# Altium project SIM_4G_EC200S.PrjPcb
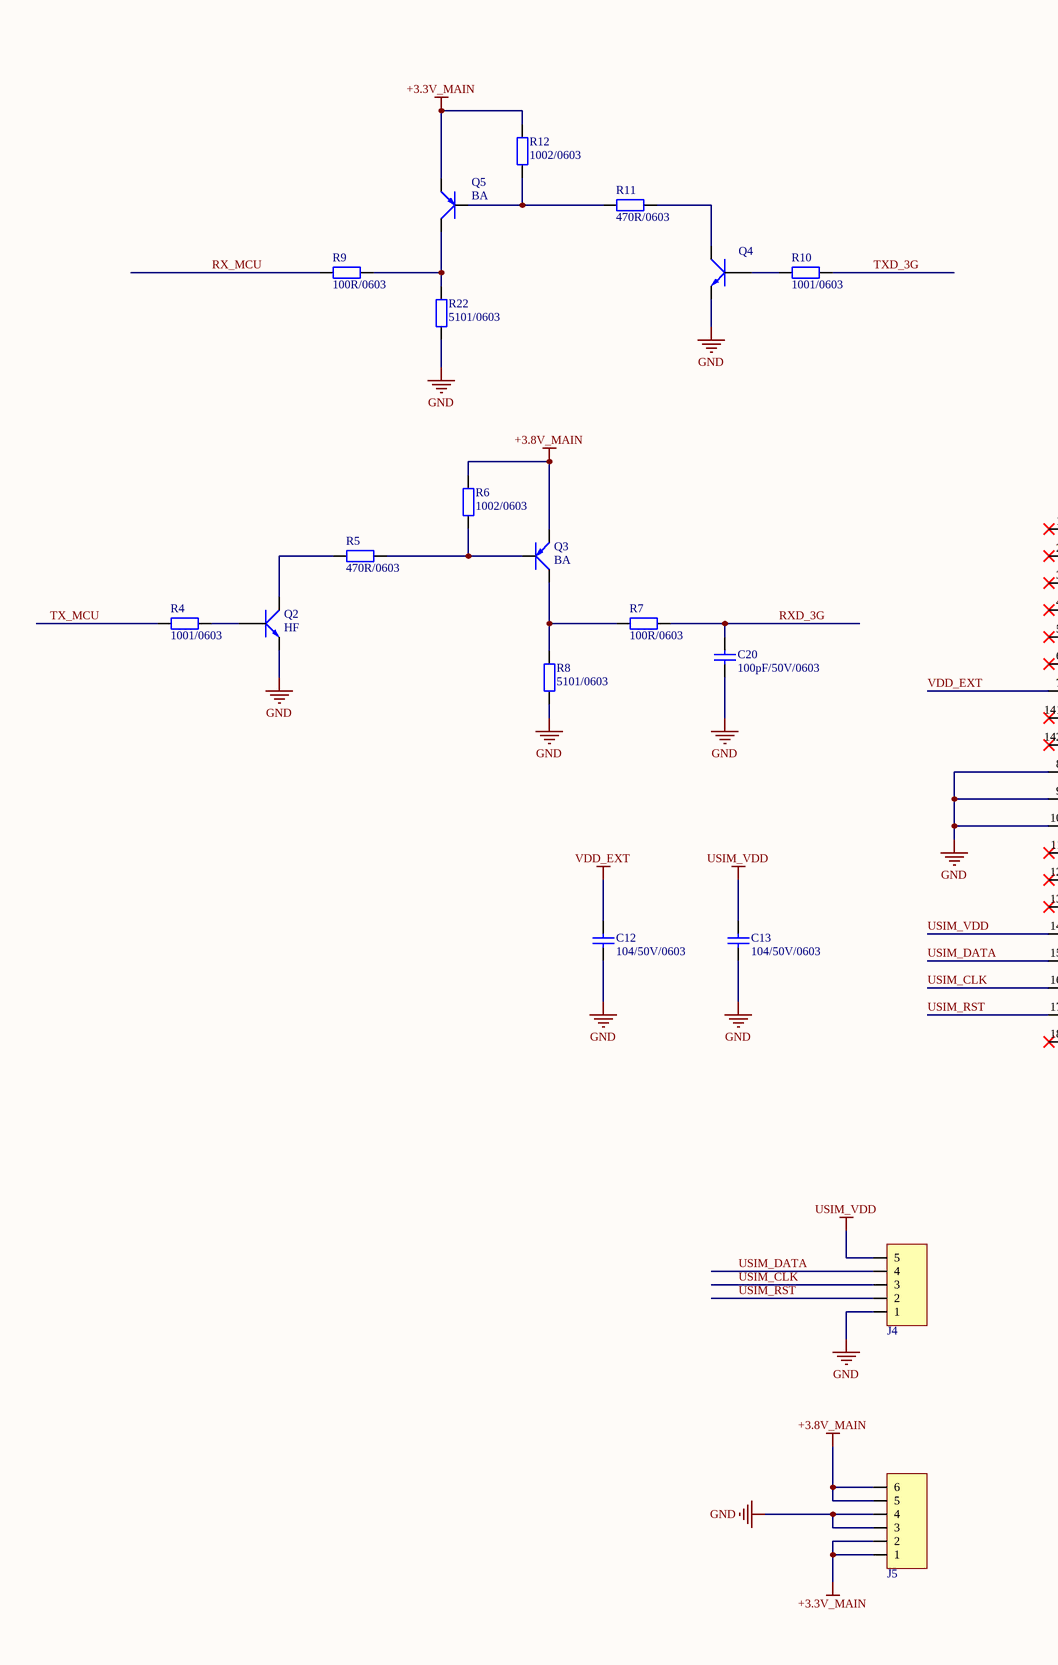
[diagram p0: SIM4G_EC200S.SchDoc, left]
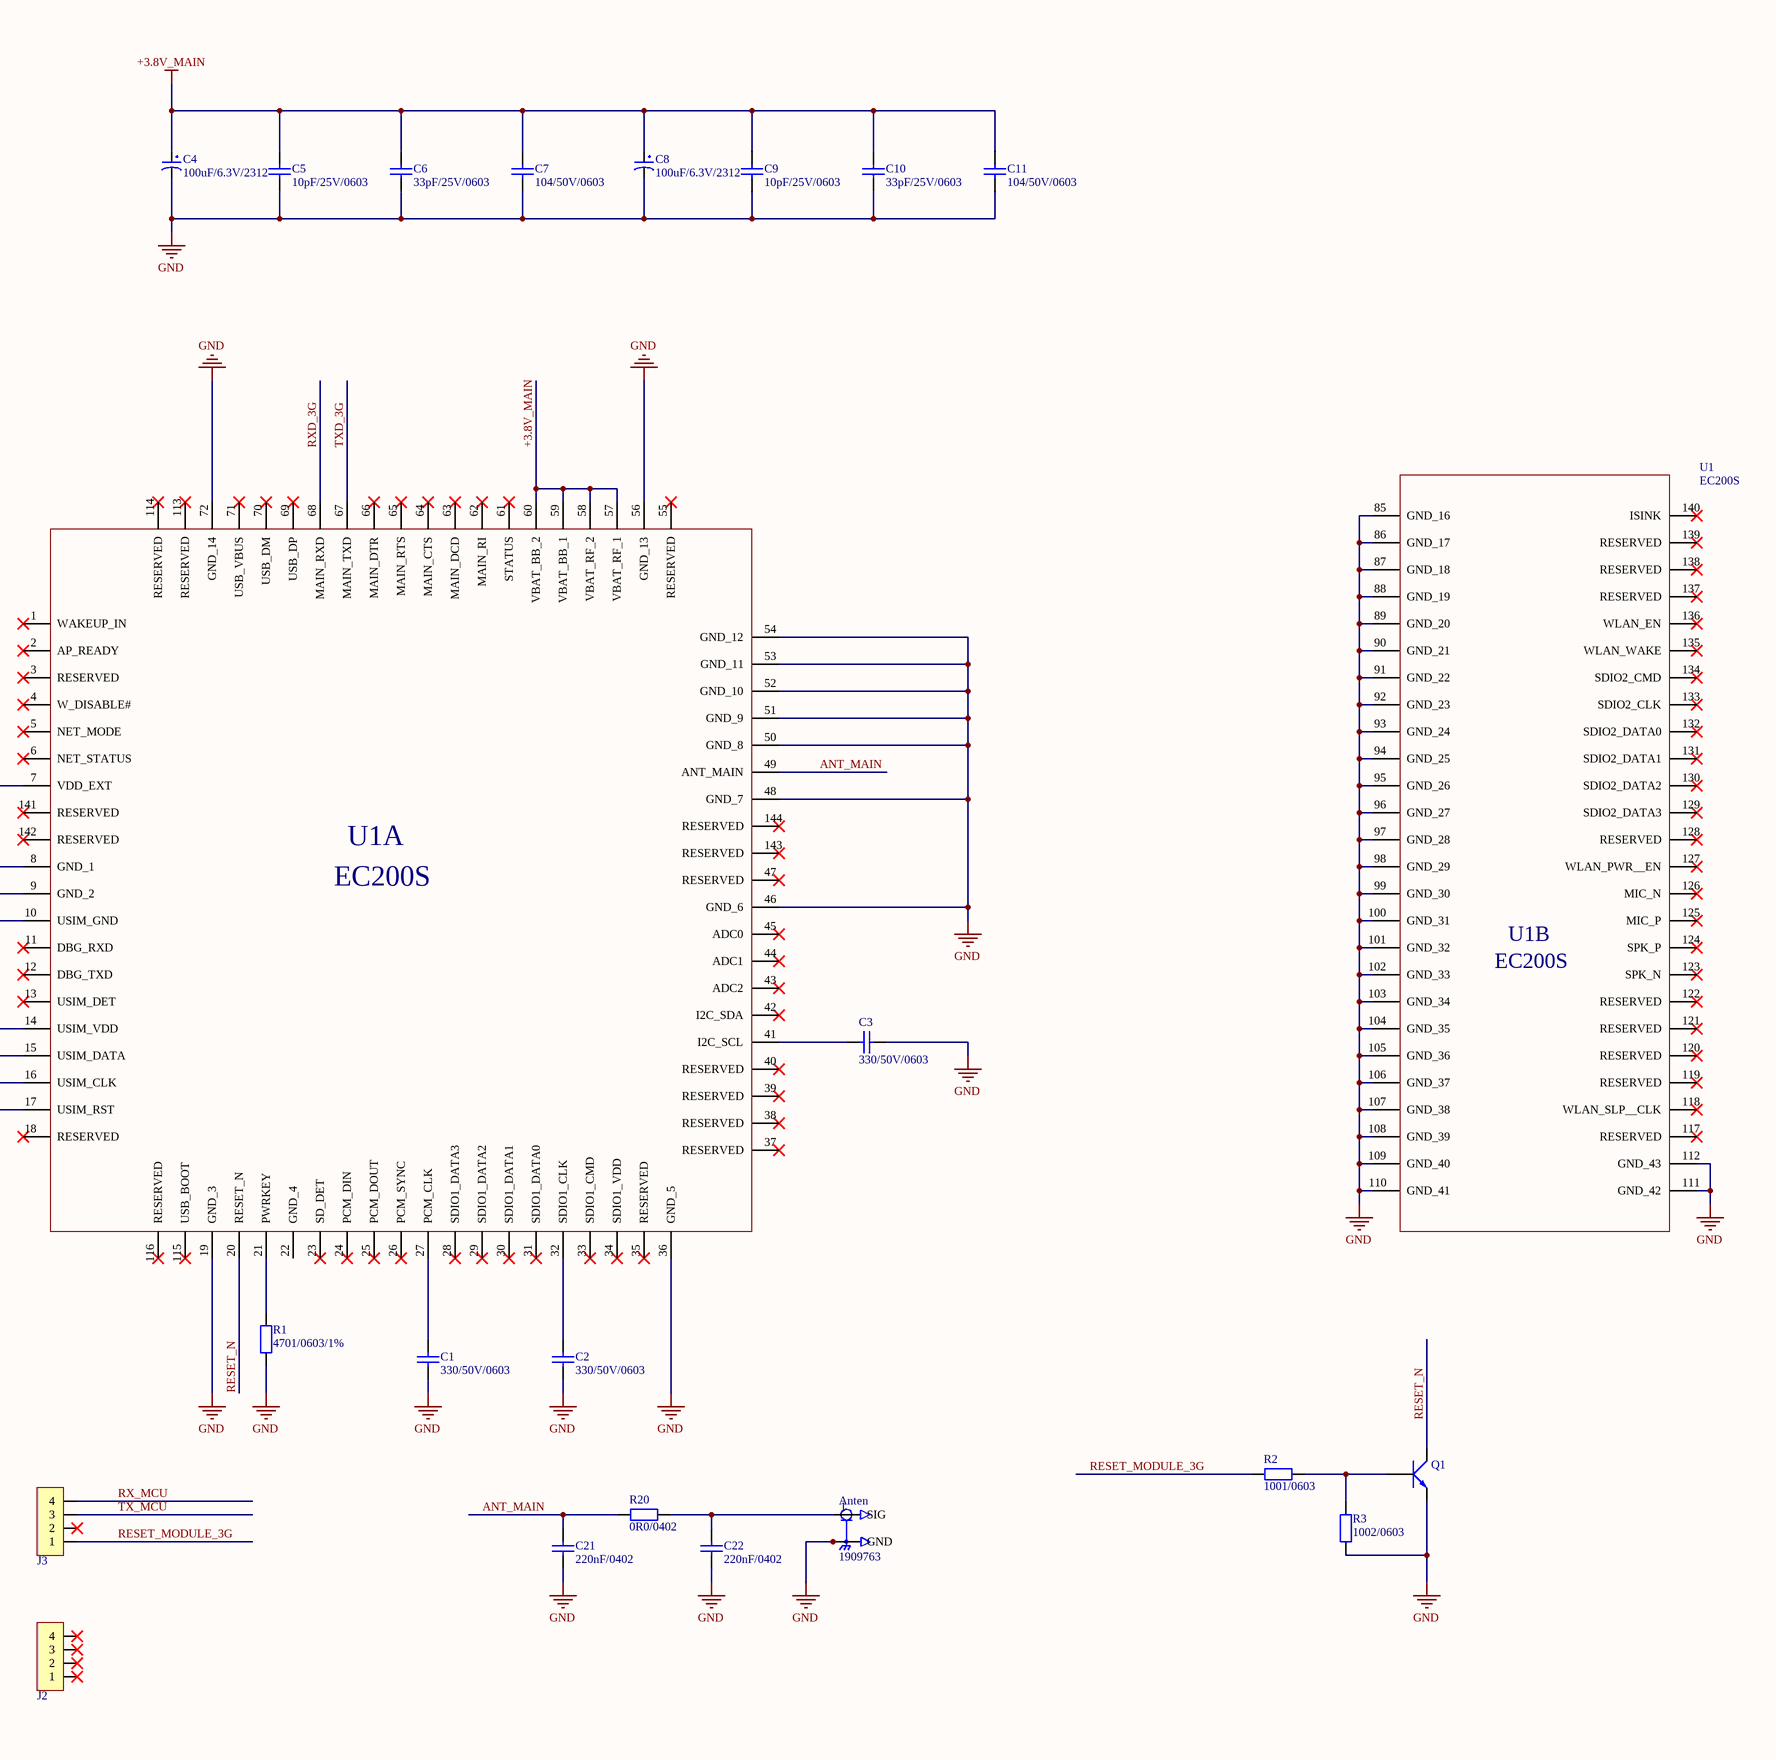
[diagram p1: SIM4G_EC200S.SchDoc, right]
1 sheet, 41 parts. Net scope: global (net labels, ports and power ports of the same name join across sheets).
Board file: SIM_4G_EC200S.PcbDoc

## Sheet SIM4G_EC200S.SchDoc
size A2; SheetNumber: 1; SheetTotal: 1

### Parts
Anten  1909763  [TE_1909763-1]
C1  330/50V/0603  [tu 0603]
C2  330/50V/0603  [tu 0603]
C3  330/50V/0603  [tu 0603]
C4  100uF/6.3V/2312  [tu tantalum smd3216]
C5  10pF/25V/0603  [tu 0603]
C6  33pF/25V/0603  [tu 0603]
C7  104/50V/0603  [tu 0603]
C8  100uF/6.3V/2312  [tu tantalum smd3216]
C9  10pF/25V/0603  [tu 0603]
C10  33pF/25V/0603  [tu 0603]
C11  104/50V/0603  [tu 0603]
C12  104/50V/0603  [tu 0603]
C13  104/50V/0603  [tu 0603]
C20  100pF/50V/0603  [tu 0603]
C21  220nF/0402  [tu 0402]
C22  220nF/0402  [tu 0402]
J2  JP 1x4 2.54  [JP 1x4 DT]  (value not drawn)
J3  JP 1x4 2.54  [JP 1x4 DT]  (value not drawn)
J4  JP 1x5 2.54  [JP 1x5 DT]  (value not drawn)
J5  JP 1x6 2.54  [JP 1x6 DT]  (value not drawn)
Q1  HF  [SOT23]  (value not drawn)
Q2  HF  [SOT23]
Q3  BA  [SOT23]
Q4  HF  [SOT23]  (value not drawn)
Q5  BA  [SOT23]
R1  4701/0603/1%  [tro smd 0603]
R2  1001/0603  [tro smd 0603]
R3  1002/0603  [tro smd 0603]
R4  1001/0603  [tro smd 0603]
R5  470R/0603  [tro smd 0603]
R6  1002/0603  [tro smd 0603]
R7  100R/0603  [tro smd 0603]
R8  5101/0603  [tro smd 0603]
R9  100R/0603  [tro smd 0603]
R10  1001/0603  [tro smd 0603]
R11  470R/0603  [tro smd 0603]
R12  1002/0603  [tro smd 0603]
R20  0R0/0402  [tro smd 0603]
R22  5101/0603  [tro smd 0603]
U1  EC200S  [EC200U]

### Nets
+3.3V_MAIN: J5.1 J5.2 Q5.2(E) R12.1
+3.8V_MAIN: C4.1 C5.1 C6.1 C7.1 C8.1 C9.1 C10.1 C11.1 J5.5 J5.6 Q3.2(E) R6.1 U1.57(VBAT_RF_1) U1.58(VBAT_RF_2) U1.59(VBAT_BB_1) U1.60(VBAT_BB_2)
GND: Anten.2(GND) Anten.3(GND) C1.2 C2.2 C3.2 C4.2 C5.2 C6.2 C7.2 C8.2 C9.2 C10.2 C11.2 C12.2 C13.2 C20.2 C21.1 C22.1 J4.1 J5.3 J5.4 Q1.2(E) Q2.2(E) Q4.2(E) R1.1 R3.2 R8.2 R22.2 U1.8(GND_1) U1.9(GND_2) U1.10(USIM_GND) U1.19(GND_3) U1.36(GND_5) U1.46(GND_6) U1.48(GND_7) U1.50(GND_8) U1.51(GND_9) U1.52(GND_10) U1.53(GND_11) U1.54(GND_12) U1.56(GND_13) U1.72(GND_14) U1.85(GND_16) U1.86(GND_17) U1.87(GND_18) U1.88(GND_19) U1.89(GND_20) U1.90(GND_21) U1.91(GND_22) U1.92(GND_23) U1.93(GND_24) U1.94(GND_25) U1.95(GND_26) U1.96(GND_27) U1.97(GND_28) U1.98(GND_29) U1.99(GND_30) U1.100(GND_31) U1.101(GND_32) U1.102(GND_33) U1.103(GND_34) U1.104(GND_35) U1.105(GND_36) U1.106(GND_37) U1.107(GND_38) U1.108(GND_39) U1.109(GND_40) U1.110(GND_41) U1.111(GND_42) U1.112(GND_43)
USIM_VDD: C13.1 J4.5 U1.14(USIM_VDD)
VDD_EXT: C12.1 U1.7(VDD_EXT)
ANT_MAIN: C21.2 R20.1 U1.49(ANT_MAIN)
RESET_MODULE_3G: J3.1 R2.2
RESET_N: Q1.3(C) U1.20(RESET_N)
RX_MCU: J3.4 R9.1
RXD_3G: C20.1 R7.1 U1.68(MAIN_RXD)
TX_MCU: J3.3 R4.2
TXD_3G: R10.2 U1.67(MAIN_TXD)
USIM_CLK: J4.3 U1.16(USIM_CLK)
USIM_DATA: J4.4 U1.15(USIM_DATA)
USIM_RST: J4.2 U1.17(USIM_RST)
NetAnten_1: Anten.1(SIG) C22.2 R20.2
NetC1_1: C1.1 U1.27(PCM_CLK)
NetC2_1: C2.1 U1.32(SDIO1_CLK)
NetC3_1: C3.1 U1.41(I2C_SCL)
NetQ1_1: Q1.1(B) R2.1 R3.1
NetQ2_1: Q2.1(B) R4.1
NetQ2_3: Q2.3(C) R5.2
NetQ3_1: Q3.1(B) R5.1 R6.2
NetQ3_3: Q3.3(C) R7.2 R8.1
NetQ4_1: Q4.1(B) R10.1
NetQ4_3: Q4.3(C) R11.2
NetQ5_1: Q5.1(B) R11.1 R12.2
NetQ5_3: Q5.3(C) R9.2 R22.1
NetR1_2: R1.2 U1.21(PWRKEY)

Not connected (* = marked no-connect by the designer): J2 1* 2* 3* 4*; J3 2*; U1 1(WAKEUP_IN)* 2(AP_READY)* 3(RESERVED)* 4(W_DISABLE#)* 5(NET_MODE)* 6(NET_STATUS)* 11(DBG_RXD)* 12(DBG_TXD)* 13(USIM_DET)* 18(RESERVED)* 22(GND_4) 23(SD_DET)* 24(PCM_DIN)* 25(PCM_DOUT)* 26(PCM_SYNC)* 28(SDIO1_DATA3)* 29(SDIO1_DATA2)* 30(SDIO1_DATA1)* 31(SDIO1_DATA0)* 33(SDIO1_CMD)* 34(SDIO1_VDD)* 35(RESERVED)* 37(RESERVED)* 38(RESERVED)* 39(RESERVED)* 40(RESERVED)* 42(I2C_SDA)* 43(ADC2)* 44(ADC1)* 45(ADC0)* 47(RESERVED)* 55(RESERVED)* 61(STATUS)* 62(MAIN_RI)* 63(MAIN_DCD)* 64(MAIN_CTS)* 65(MAIN_RTS)* 66(MAIN_DTR)* 69(USB_DP)* 70(USB_DM)* 71(USB_VBUS)* 113(RESERVED)* 114(RESERVED)* 115(USB_BOOT)* 116(RESERVED)* 117(RESERVED)* 118(WLAN_SLP__CLK)* 119(RESERVED)* 120(RESERVED)* 121(RESERVED)* 122(RESERVED)* 123(SPK_N)* 124(SPK_P)* 125(MIC_P)* 126(MIC_N)* 127(WLAN_PWR__EN)* 128(RESERVED)* 129(SDIO2_DATA3)* 130(SDIO2_DATA2)* 131(SDIO2_DATA1)* 132(SDIO2_DATA0)* 133(SDIO2_CLK)* 134(SDIO2_CMD)* 135(WLAN_WAKE)* 136(WLAN_EN)* 137(RESERVED)* 138(RESERVED)* 139(RESERVED)* 140(ISINK)* 141(RESERVED)* 142(RESERVED)* 143(RESERVED)* 144(RESERVED)*

### Notes on the sheet
- (in symbol EC200S) U1A; U1B

### Library data of the parts
Anten = Antenna: VAO ITEM, MINI RF HEADER; MP: 1909763-1; Value: *; Package: None; Availability: Unavailable; Price: None
C1-C3 C5-C7 C9-C13 C20 = Tu 0603 563 16V 10%: Dán; Don_Vi: Con; So_Chan: 2; Ten_Linh_Kien: Tụ 0603 563-56nF 10% 16V; Ma_Hang: MH004573; Chung_Loai: Dán; Kieu_Chan: *
C4 C8 = Tu tantalum 10uF 16V SMD3216: Dán; Don_Vi: Con; So_Chan: 2; Ten_Linh_Kien: Tụ tantalum 106C-10uF 16V SMD3216; Ma_Hang: MH001954; Chung_Loai: Dán; Kieu_Chan: *
C21 C22 = Tu 0402 220nF 6.3V 20%: Dán; Don_Vi: Con; So_Chan: 2; Ten_Linh_Kien: Tụ 0402 220nF 6.3V 20%; Ma_Hang: MH008102; Chung_Loai: Dán; Kieu_Chan: *
J2 J3 = JP 1x4 2.54 Duc Thang: Cắm; Ten_Linh_Kien: Jump Đơn Đực 2.54MM 1x40P Thẳng 11MM; Don_Vi: Con; Ma_Hang: MH000903; Ghi_Chu: *; Kieu_Chan: *; Chung_Loai: Cắm
J4 = JP 1x5 2.54 Duc Thang: Cắm; Ten_Linh_Kien: Jump Đơn Đực 2.54MM 1x40P Thẳng 11MM; Don_Vi: Con; Ma_Hang: MH000903; Ghi_Chu: *; Kieu_Chan: *; Chung_Loai: Cắm
J5 = JP 1x6 2.54 Duc Thang: Cắm; Ten_Linh_Kien: Jump Đơn Đực 2.54MM 1x40P Thẳng 11MM; Don_Vi: Con; Ma_Hang: MH000903; Ghi_Chu: *; Kieu_Chan: *; Chung_Loai: Cắm
Q1 Q2 Q4 = C1815 HF SMD: NPN transistor; Value: C9014
Q3 = A1015 BA SMD: PMBT3906,235 / MMBT4403/SOT_0
Q5 = A1015 BA SMD: PNP 600mW, ECB
R1-R12 R20 R22 = Tro 0603 5% 510R: Dán; Don_Vi: Con; So_Chan: 2; Ten_Linh_Kien: Trở 0603 5% 510R; Ma_Hang: MH007667; Chung_Loai: Dán; Kieu_Chan: *
U1 = EC200S: GMS/4G-LTE